# Altium schematic sheet 102711.SchDoc: V40 Test Head Board
size A4; Author: DMH; CompanyName: Detex Corp; Engineer: DMH; Address2: Detex Corp; Address3: 302 Detex Dr; Address4: New Braunfels, TX 78130; DocumentNumber: 102711; Revision: A0; SheetNumber: 1; SheetTotal: 1; DocumentName: V40 Test Head Board; ProjectName: V40 Test Head Board
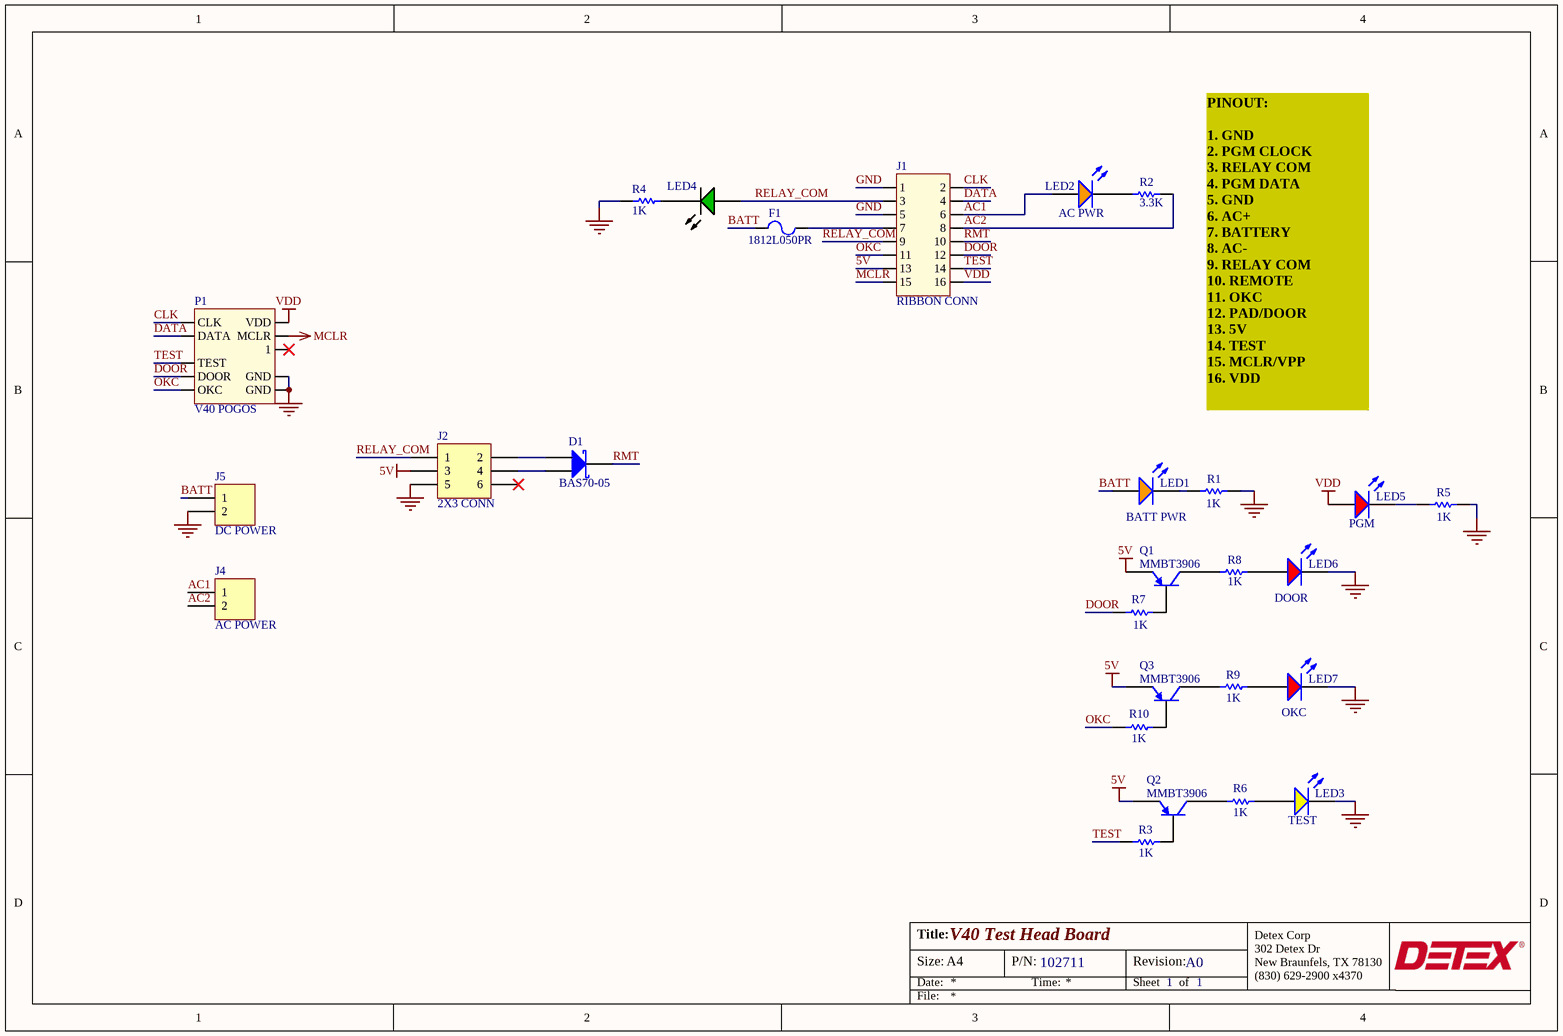
[diagram p0: 102711.SchDoc]

## Parts
D1  BAS70-05  [SOT-23_M]
F1  1812L050PR  [LFUS-1812L050_V]
J1  DESC: RIBBON CONN  [HDR2X8]  (hidden comment: 2x8 Header)
J2  2X3 CONN  [HDR2X3]
J4  AC POWER  [HDR1X2]
J5  DC POWER  [BAT_CONN]
LED1  BATT PWR  [LTST-C170YKT_V]
LED2  AC PWR  [LTST-C170YKT_V]
LED3  DESC: TEST  [LTST-C170YKT_V]  (hidden comment: LTST-C170YKT)
LED4  LTST-C190GKT  [LTST-C170YKT_V]  (value not drawn)
LED5  DESC: PGM  [LTST-C170YKT_V]  (hidden comment: LTST-C170CKT)
LED6  DESC: DOOR  [LTST-C170YKT_V]  (hidden comment: LTST-C170CKT)
LED7  DESC: OKC  [LTST-C170YKT_V]  (hidden comment: LTST-C170CKT)
P1  V40 POGOS  [V40_POGOS]
Q1  MMBT3906  [FAIR-SOT23-3_V]
Q2  MMBT3906  [FAIR-SOT23-3_V]
Q3  MMBT3906  [FAIR-SOT23-3_V]
R1  value 1K  [RESC0805(2012)_M]  (hidden comment: Res1)
R2  value 3.3K  [RESC0805(2012)_M]  (hidden comment: Res1)
R3  value 1K  [RESC0805(2012)_M]  (hidden comment: Res1)
R4  value 1K  [RESC0805(2012)_M]  (hidden comment: Res1)
R5  value 1K  [RESC0805(2012)_M]  (hidden comment: Res1)
R6  value 1K  [RESC0805(2012)_M]  (hidden comment: Res1)
R7  value 1K  [RESC0805(2012)_M]  (hidden comment: Res1)
R8  value 1K  [RESC0805(2012)_M]  (hidden comment: Res1)
R9  value 1K  [RESC0805(2012)_M]  (hidden comment: Res1)
R10  value 1K  [RESC0805(2012)_M]  (hidden comment: Res1)

## Nets
5V: J1.13 J2.3 Q1.2(E) Q2.2(E) Q3.2(E)
GND: J1.1 J1.5 J2.5 J5.2 LED3.2(K) LED6.2(K) LED7.2(K) P1.2(GND) P1.8(GND) R1.2 R4.2 R5.2
MCLR: J1.15 P1.5(MCLR)
VDD: J1.16 LED5.1(A) P1.6(VDD)
AC1: J1.6 J4.1 LED2.1(A)
AC2: J1.8 J4.2 R2.2
BATT: F1.1 J5.1 LED1.1(A)
CLK: J1.2 P1.3(CLK)
DATA: J1.4 P1.4(DATA)
DOOR: J1.12 P1.9(DOOR) R7.1
OKC: J1.11 P1.10(OKC) R10.1
RELAY_COM: J1.3 J1.9 J2.1 LED4.1(A)
RMT: D1.3(K) J1.10
TEST: J1.14 P1.7(TEST) R3.1
NetD1_1: D1.1(A) J2.4
NetD1_2: D1.2(A) J2.2
NetF1_2: F1.2 J1.7
NetLED1_2: LED1.2(K) R1.1
NetLED2_2: LED2.2(K) R2.1
NetLED3_1: LED3.1(A) R6.2
NetLED4_2: LED4.2(K) R4.1
NetLED5_2: LED5.2(K) R5.1
NetLED6_1: LED6.1(A) R8.2
NetLED7_1: LED7.1(A) R9.2
NetQ1_1: Q1.1(B) R7.2
NetQ1_3: Q1.3(C) R8.1
NetQ2_1: Q2.1(B) R3.2
NetQ2_3: Q2.3(C) R6.1
NetQ3_1: Q3.1(B) R10.2
NetQ3_3: Q3.3(C) R9.1

Not connected (* = marked no-connect by the designer): J2 6*; P1 1*

## Notes on the sheet
- (near R2) PINOUT:
  1. GND
  2. PGM CLOCK
  3. RELAY COM
  4. PGM DATA
  5. GND
  6. AC+
  7. BATTERY
  8. AC-
  9. RELAY COM
  10. REMOTE
  11. OKC
  12. PAD/DOOR
  13. 5V
  14. TEST
  15. MCLR/VPP
  16. VDD
- Title:
- Size:
- Date:
- A4
- P/N:
- Time:
- Revision:
- Sheet
- of
- (830) 629-2900 x4370
- File:

## Library data of the parts
D1 = D Schottky: Dual Schottky Diode; MFR: DIODES, INC; IFmax: 70mA; PackageReference: SOT23; ComponentLink1URL: http://www.mouser.com/ds/2/115/ds11007-768590.pdf; MFR P/N: BAS70-05; ComponentLink1Description: Datasheet
F1 = CMP-1700-00002-1: POLY-FUSE(R) Resettable PTC, 0.5 A, 0.15 to 1 Ohm Resistance, -40 to 85 degC, 1812 (4532 Metric), RoHS, Tape and Reel; Voltage Rating: 50 V; Power Rating: 100 mW; Resistance: 150 kohm; Tolerance: 1%; Case\Package: 0603; ComponentLink2URL: http://www.littelfuse.com/~/media/electronics/datasheets/resettable_ptcs/littelfuse_ptc_1812l_datasheet.pdf.pdf; Pins: 2; Mount: Surface Mount; Width: 0.8 mm; Length: 1.6 mm; Package Quantity: 1; Max Operating Temperature: 155 degC; Case Code (Imperial): 0603; ComponentLink1Description: Manufacturer URL; PackageReference: 1812; ComponentLink1URL: http://www.littelfuse.com/; RoHSCompliant: true; Voltage Rating (DC): 50 V; Packaging: Tape and Reel; PackageDescription: 2-Pin Surface Mount Device, Body 4.55 x 3.24 mm; Min Operating Temperature: -55 degC; DatasheetVersion: Feb-16; REACH SVHC: No SVHC; Case Code (Metric): 1608; ComponentLink2Description: Datasheet; Height: 0.45 mm
J1 = 2x9 Header
J2 = Header 3X2: Header, 3-Pin, Dual row; LatestRevisionDate: 17-Jul-2002; LatestRevisionNote: Re-released for DXP Platform.; Publisher: Altium Limited
J4 J5 = Header 2: Header, 2-Pin; LatestRevisionDate: 17-Jul-2002; LatestRevisionNote: Re-released for DXP Platform.; Publisher: Altium Limited
LED1 LED2 = LED-ORANGE-AK-2
LED3 = CMP-1674-00003-5: LED Uni-Color Yellow, 60 mW, 80 mA, -55 to 85 degC, 2-Pin SMD, RoHS, Tape and Reel; Manufacturer: Lite-On; Mounting Technology: Surface Mount; Height: 1.1 mm; Mount: Surface Mount; Packaging: Tape and Reel; Length: 2 mm; RoHSCompliant: true; Colour: Yellow; Max Operating Temperature: 85 degC; PackageReference: C170YKT; ComponentLink1Description: Manufacturer URL; Min Operating Temperature: -55 degC; ComponentLink1URL: http://www.us.liteon.com/; DatasheetVersion: 03/2000; PackageDescription: 2-Pin Surface Mount Device, Body 2 x 1.25 mm; ComponentLink2URL: http://media.digikey.com/pdf/Data Sheets/Lite-On PDFs/LTST-C170YKT.pdf; Package Quantity: 3000; ComponentLink2Description: Datasheet; Pins: 2
LED4 = CMP-1674-00007-1: LED Uni-Color Green, 100 mW, 5 V, -55 to 85 degC, 2-Pin SMD, RoHS, Tape and Reel; ComponentLink2Description: Datasheet; ComponentLink2URL: http://datasheet.octopart.com/LTST-C190GKT-Lite-On-datasheet-158530.pdf; ComponentLink1Description: Manufacturer URL; PackageReference: C190GKT; PackageDescription: 2-Pin Surface Mount Device, Body 1.6 x 0.8 mm; ComponentLink1URL: http://www.us.liteon.com/; DatasheetVersion: Dec-06
LED5-LED7 = CMP-1674-00001-5: LED Uni-Color Red, 100 mW, 200 mA, -55 to 85 degC, 2-Pin SMD, RoHS, Tape and Reel; Manufacturer: Lite-On; ComponentLink1Description: Manufacturer URL; PackageReference: C170CKT; Package Quantity: 3000; Packaging: Tape and Reel; Pins: 2; ComponentLink2URL: http://media.digikey.com/pdf/Data%20Sheets/Lite-On%20PDFs/LTST-C170CKT.pdf; Max Operating Temperature: 85 degC; Min Operating Temperature: -55 degC; ComponentLink1URL: http://www.us.liteon.com/; Mounting Technology: Surface Mount; Mount: Surface Mount; Length: 2 mm; ComponentLink2Description: Datasheet; DatasheetVersion: 03/2003; Height: 1.1 mm; PackageDescription: 2-Pin Surface Mount Device, Body 2 x 1.25 mm; RoHSCompliant: true; Colour: Red
P1 = V40_POGOS
Q1-Q3 = CMP-1670-00011-1: PNP General-Purpose Amplifier, 40 V, 0.2 A, -55 to 150 degC, 3-Pin SOT23, RoHS, Tape and Reel; Tolerance: 20%; Capacitance: 1 uF; Voltage Rating (DC): 50 V; Case\Package: Radial; Radiation Hardening: No; REACH SVHC: No SVHC; Height: 11 mm; Length: 12 mm; Pins: 2; Min Operating Temperature: -55 degC; ComponentLink1Description: Manufacturer URL; Mount: Through Hole; ComponentLink2URL: https://www.fairchildsemi.com/datasheets/MM/MMBT3906.pdf; ComponentLink3Description: Package Specification; Package Quantity: 200; Diameter: 5 mm; Width: 0 inch; Voltage Rating: 50 V; ComponentLink2Description: Datasheet; PackageDescription: 3-Pin Small Outline Transistor, Body 2.92 x 1.325 mm, Pitch 0.95 mm; DatasheetVersion: Rev. 1.2.2, 04/2014; Max Operating Temperature: 105 degC; RoHSCompliant: true; PackageReference: SOT23-3; Lead Pitch: 2 mm; Packaging: Bulk; ComponentLink3URL: http://www.fairchildsemi.com/dwg/MA/MA03D.pdf; ComponentLink1URL: https://www.fairchildsemi.com/
R1-R10 = Res1: Resistor; Published: 8-Jun-2000; LatestRevisionDate: 17-Jul-2002; LatestRevisionNote: Re-released for DXP Platform.; PackageReference: AXIAL-0.3; Publisher: Altium Limited; PackageDescription: Axial Device, Thru-Hole; 2 Leads; 0.3 in Pin Spacing